# Altium schematic sheet adjustable_biasing_pots.SchDoc
size A; SheetNumber: 5; SheetTotal: 9
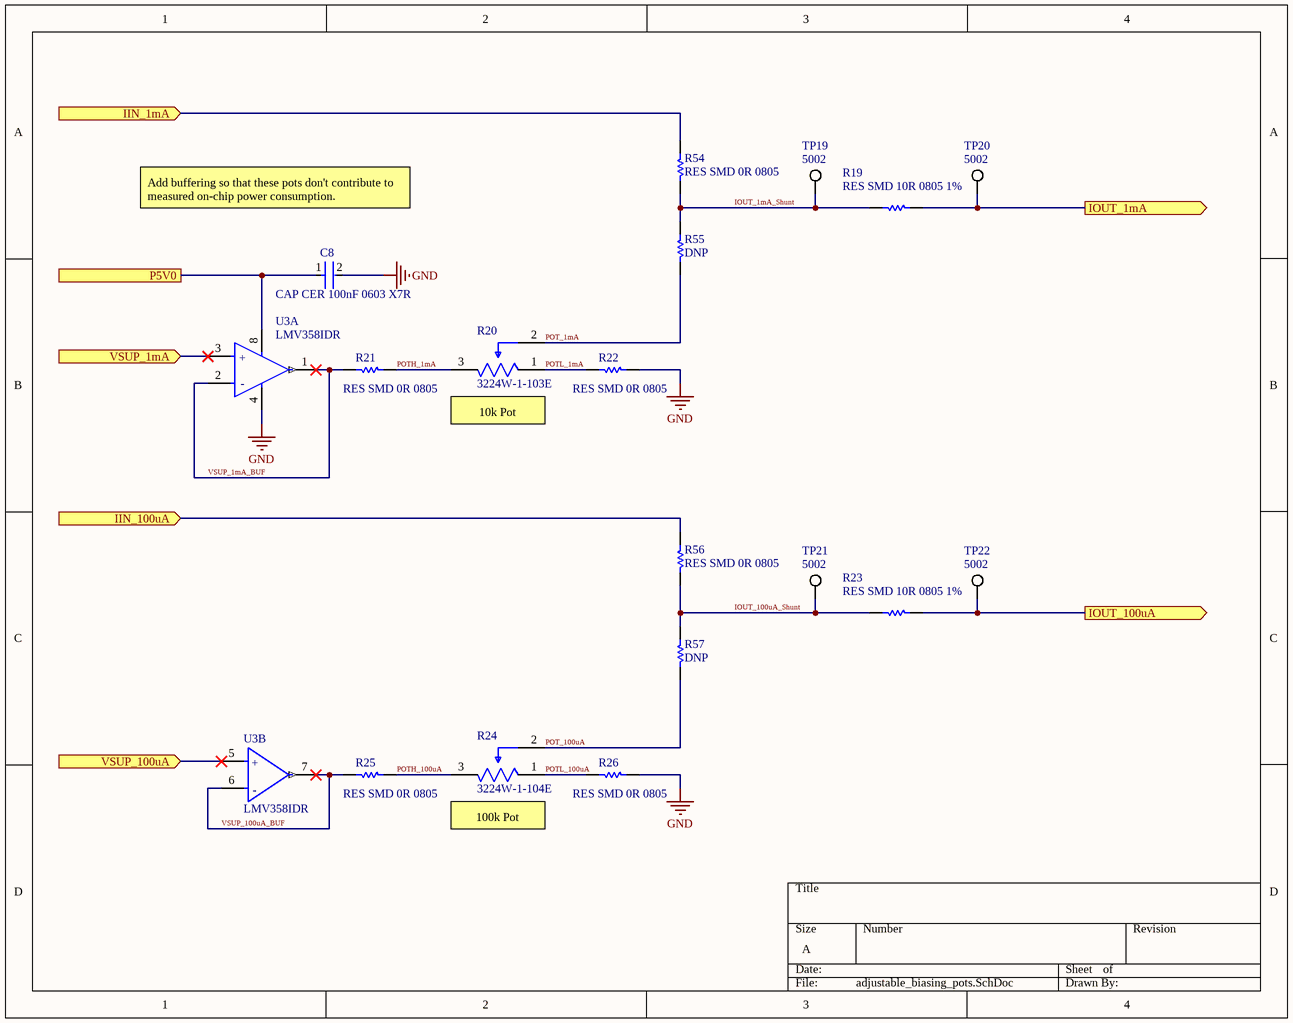
[diagram p0: adjustable_biasing_pots.SchDoc]

## Parts
C8  CAP CER 100nF 0603 X7R  [FP-CC0603-DA-MFG]
R19  RES SMD 10R 0805 1%  [RESC2013X55X40NL15T20]
R20  3224W-1-103E  [FP-3224W-MFG]
R21  RES SMD 0R 0805  [RESC2013X55X40NL15T20]
R22  RES SMD 0R 0805  [RESC2013X55X40NL15T20]
R23  RES SMD 10R 0805 1%  [RESC2013X55X40NL15T20]
R24  3224W-1-104E  [FP-3224W-MFG]
R25  RES SMD 0R 0805  [RESC2013X55X40NL15T20]
R26  RES SMD 0R 0805  [RESC2013X55X40NL15T20]
R54  RES SMD 0R 0805  [RESC2013X55X40NL15T20]
R55  DNP  [RESC2013X55X40NL15T20]
R56  RES SMD 0R 0805  [RESC2013X55X40NL15T20]
R57  DNP  [RESC2013X55X40NL15T20]
TP19  5002  [KSTN-5002]
TP20  5002  [KSTN-5002]
TP21  5002  [KSTN-5002]
TP22  5002  [KSTN-5002]
U3  LMV358IDR  [FP-D0008A-MFG]  (parts A,B of 2)

## Ports
IIN_1mA (in), IIN_100uA (in), IOUT_1mA (out), IOUT_100uA (out), P5V0, VSUP_1mA (in), VSUP_100uA (in)

## Nets
GND: C8.2 R22.2 R26.2 U3.4(GND)
IIN_1mA: R54.2 ; port IIN_1mA
IIN_100uA: R56.2 ; port IIN_100uA
IOUT_1mA: R19.2 TP20.1 ; port IOUT_1mA
IOUT_1mA_Shunt: R19.1 R54.1 R55.2 TP19.1
IOUT_100uA: R23.2 TP22.1 ; port IOUT_100uA
IOUT_100uA_Shunt: R23.1 R56.1 R57.2 TP21.1
P5V0: C8.1 U3.8(VCC+) ; port P5V0
POT_1mA: R20.2(WIPER) R55.1
POT_100uA: R24.2(WIPER) R57.1
POTH_1mA: R20.3(CW) R21.2
POTH_100uA: R24.3(CW) R25.2
POTL_1mA: R20.1(CCW) R22.1
POTL_100uA: R24.1(CCW) R26.1
VSUP_1mA: U3.3(1IN+) ; port VSUP_1mA
VSUP_1mA_BUF: R21.1 U3.1(OUT) U3.2(1IN-)
VSUP_100uA: U3.5(2IN+) ; port VSUP_100uA
VSUP_100uA_BUF: R25.1 U3.6(2IN-) U3.7(2OUT)

## Notes on the sheet
- Add buffering so that these pots don't contribute to measured on-chip power consumption.
- (near R20) 10k Pot
- (near R24) 100k Pot
- (in symbol CMP-04895-000136-1, part A) +; -
- (in symbol CMP-04895-000136-1, part B) +; -

## Library data of the parts
C8 = CMP-03422-000030-1: CAP CER 0.1UF 16V X7R 0603; Manufacturer Part Number: CC0603KRX7R7BB104; Manufacturer: YAGEO; Tolerance: 0.1; Temperature Coefficient: 15%; Material: Ceramic; Voltage Rating: 16 V; Package: CC0603-DA; ComponentLink2Description: Datasheet; Octopart: https://octopart.com/cc0603krx7r7bb104-yageo-192941; Temperature Range High: +125°C; Digikey Description: CAP CER 0.1UF 16V X7R 0603; Value: 100 nF; Voltage: 16 V; Device Class L2: Capacitors; Height: 0.9mm; Temperature: -55°C to +125°C; Device Class L1: Passive Components; Device Class L3: Ceramic Capacitors; ComponentLink2URL: http://www.yageo.com/documents/recent/UPY-GPHC_X7R_6.3V-to-50V_18.pdf; Footprint Url: http://www.yageo.com/exep/pages/download/literatures/UPY-C_GEN_24.pdf; RoHS: TRUE; Temperature Range Low: -55°C; Temperature Characteristic: X7R; Lead Free: Yes; Capacitance: 100 nF; Category: Cap; Mouser Description: Multilayer Ceramic Capacitor, CC Series, 0.1 - F, - 10%, X7R, 16 V, 0603 [1608 Metric]; Automotive: No
R19 R21-R23 R25 R26 R54-R57 = CMP-2001-04723-1: Manufacturer: Vishay Dale; Part Number: TNPW0805100RBEEA
R20 = CMP-07234-000002-1: TRIMMER 10K OHM 0.25W J LEAD TOP; Manufacturer: Bourns; Tolerance: 10%; Resistance: 10kΩ; Temperature Coefficient: 100ppm/°C; Value: 10kΩ; Standoff Height: 0.2mm; Voltage Rating: 300V; Power Rating: 250mW; Device Class L3: Variable Resistors and Potentiometers; Composition: Cermet; Temperature Range Low: -65°C; Package: 3224W; ComponentLink2Description: Datasheet; Digikey Description: TRIMMER 10K OHM 0.25W J LEAD TOP; Category: Res; Mouser Description: Trimmer Resistors - SMD 4mm 10Kohms 10% Square Cermet Sealed; Temperature: -65°C to +150°C; Device Class L2: Resistors; Device Class L1: Passive Components; RoHS: TRUE; Temperature Range High: +150°C; Manufacturer Part Number: 3224W-1-103E; ComponentLink2URL: https://upverter.com/datasheet/a166fca85da25564670351d2dc712345c058bc40.pdf; Series: 3224; Height: 5.55mm; Lead Free: Yes; Octopart: https://octopart.com/3224w-1-103e-bourns-14818; Automotive: No
R24 = CMP-07234-000002-1: TRIMMER 10K OHM 0.25W J LEAD TOP; Manufacturer: Bourns; Manufacturer Part Number: 3224W-1-103E; Tolerance: 10%; Resistance: 10kΩ; Temperature Coefficient: 100ppm/°C; Value: 10kΩ; Standoff Height: 0.2mm; Voltage Rating: 300V; Power Rating: 250mW; Device Class L3: Variable Resistors and Potentiometers; Composition: Cermet; Temperature Range Low: -65°C; Package: 3224W; ComponentLink2Description: Datasheet; Digikey Description: TRIMMER 10K OHM 0.25W J LEAD TOP; Category: Res; Mouser Description: Trimmer Resistors - SMD 4mm 10Kohms 10% Square Cermet Sealed; Temperature: -65°C to +150°C; Device Class L2: Resistors; Device Class L1: Passive Components; RoHS: TRUE; Temperature Range High: +150°C; ComponentLink2URL: https://upverter.com/datasheet/a166fca85da25564670351d2dc712345c058bc40.pdf; Series: 3224; Height: 5.55mm; Lead Free: Yes; Octopart: https://octopart.com/3224w-1-103e-bourns-14818; Automotive: No
TP19-TP22 = CMP-2000-05182-1: Test Point, White, 1-Pin THD, RoHS, Bulk; Manufacturer: KeystoneElectronics; Outside Diameter: 2.54mm; Plating: Silver; Mounting Hole Size: 1mm; Product: TestPoints; Packaging: Bulk; Manufacturer URL: http://www.keyelco.com/; Length: 7.62mm; Datasheet Version: Rev. G, 12/2008; Type: Miniature; Product Category: CircuitBoardHardware-PCB; Material: Nylon; RoHS: True; Contact Material: PhosphorBronze; Datasheet URL: https://ciiva.com/datasheet-click-2917627?src=ciiva&sig=bd195616; Color: White; Brand: KeystoneElectronics
U3 = CMP-04895-000136-1: IC OPAMP GP 2 CIRCUIT 8SOIC; Number of Elements: 2; Min Supply Voltage: 2.7V; Input Bias Current: 250nA; Output Current per Channel: 160mA; Bandwidth: 1MHz; Voltage Gain: 100dB; Input Offset Voltage (Vos): 7mV; Slew Rate: 1V/µs; Nominal Supply Current: 440uA; Power Supply Rejection Ratio (PSRR): 50dB; Max Supply Voltage: 5.5V; Operating Supply Current: 210uA; Lead Free: Lead Free; Length: 4.9mm; RoHS Compliant: Yes; REACH SVHC: No SVHC; Case/Package: SOIC; Height: 1.58mm; Number of Channels: 2; Number of Amplifiers: 2; Radiation Hardening: No; Number of Circuits: 2; Mount: Surface Mount; Contact Plating: Gold; Unity Gain Bandwidth Product: 1MHz; Min Operating Temperature: -40°C; Max Operating Temperature: 125°C; Width: 3.91mm; Gain Bandwidth Product: 1MHz; Number of Pins: 8; Packaging: Tape and Reel; Package Quantity: 2500; Output Current: 160mA; Common Mode Rejection Ratio: 50dB